# Altium schematic sheet RS485 Com and Connectors.SchDoc
size A4; SheetNumber: 3; SheetTotal: 6
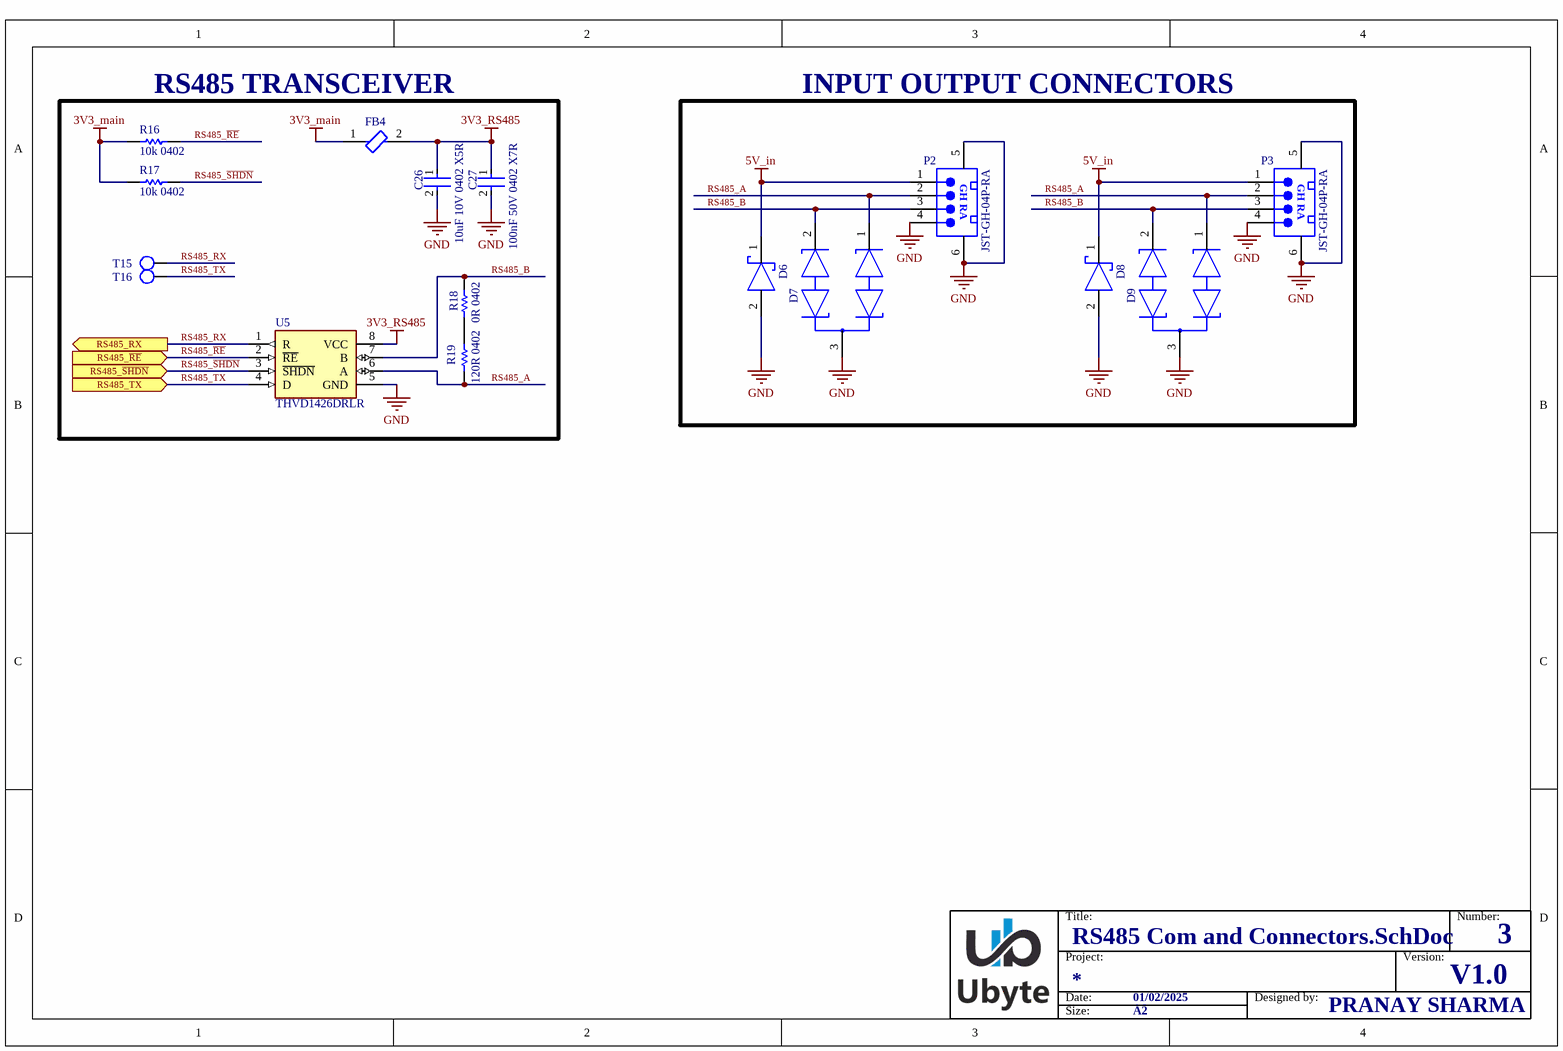
[diagram p0: RS485 Com and Connectors.SchDoc]

## Parts
C26  10uF 10V 0402 X5R  [0402 IPC CLASS C CAPACITOR]
C27  100nF 50V 0402 X7R  [0402 IPC CLASS C CAPACITOR]
D6  SP3031-01ETG  [SOD882 IPC-C]  (value not drawn)
D7  SM712  [FP-SOT23-IPC_C]  (value not drawn)
D8  SP3031-01ETG  [SOD882 IPC-C]  (value not drawn)
D9  SM712  [FP-SOT23-IPC_C]  (value not drawn)
FB4  BLM15AX102SN1D  [0402 IPC CLASS C FERRITE BEAD]  (value not drawn)
P2  JST-GH-04P-RA  [JST-GH-04P-RA]
P3  JST-GH-04P-RA  [JST-GH-04P-RA]
R16  10k 0402  [0402 IPC CLASS C RESISTOR]
R17  10k 0402  [0402 IPC CLASS C RESISTOR]
R18  0R 0402  [0402 IPC CLASS B RESISTOR]
R19  120R 0402  [0402 IPC CLASS C RESISTOR]
T15  TP  [Testpoint1]  (value not drawn)  (no BOM)
T16  TP  [Testpoint1]  (value not drawn)  (no BOM)
U5  THVD1426DRLR  [DRL0008A IPC-C]

## Blocks framed on the sheet
RS485 TRANSCEIVER: C26 C27 FB4 R16-R19 T15 T16 U5
INPUT OUTPUT CONNECTORS: D6-D9 P2 P3

## Ports
RS485_RX (out), RS485_TX (in), RS485_~{RE} (in), RS485_~{SHDN} (in)

## Nets
3V3_main: FB4.1 R16.2 R17.2
3V3_RS485: C26.1 C27.1 FB4.2 U5.8(VCC)
5V_in: D6.1(C) D8.1(C) P2.1 P3.1
GND: C26.2 C27.2 D6.2(A) D7.3(CC) D8.2(A) D9.3(CC) P2.4 P2.5 P2.6 P3.4 P3.5 P3.6 U5.5(GND)
RS485_A: D7.1(K1) D9.1(K1) P2.2 P3.2 R19.1 U5.6(A)
RS485_B: D7.2(K2) D9.2(K2) P2.3 P3.3 R18.2 U5.7(B)
RS485_~{RE}: R16.1 U5.2(~{RE}) ; port RS485_~{RE}
RS485_RX: T15.0 U5.1(R) ; port RS485_RX
RS485_~{SHDN}: R17.1 U5.3(~{SHDN}) ; port RS485_~{SHDN}
RS485_TX: T16.0 U5.4(D) ; port RS485_TX
NetR18_1: R18.1 R19.2

## Notes on the sheet
- Title:
- Number:
- Date:
- Project:
- 01/02/2025
- Designed by:
- Version:
- V1.0
- Size:
- A2
- PRANAY SHARMA
- (in symbol JST-GH-04P-RA) GH RA

## Library data of the parts
R16 R17 = 10k 1% 0402
R18 = 0R 1% 0402
R19 = 120R 1% 0402
T15 T16 = Testpoint1